# EAGLE schematic word_clock (EAGLE 7.2.0)
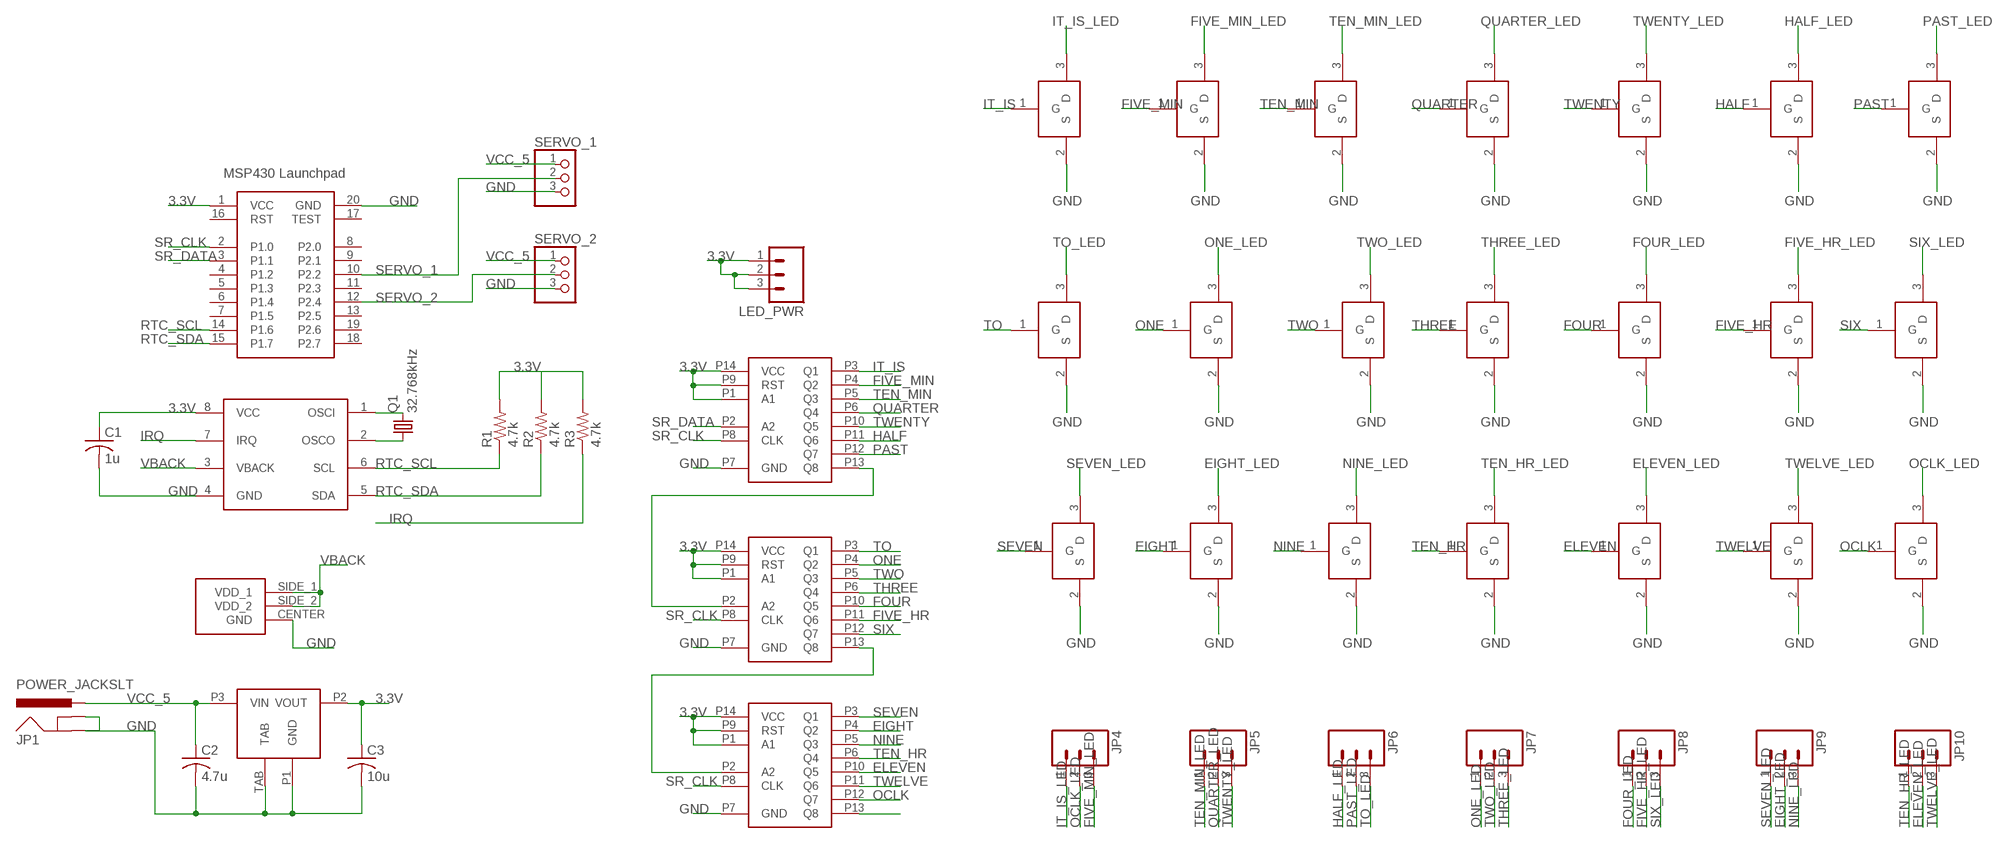
[diagram p0: schematic, sheet 1]

## Parts
1H  FET  [SOT23]
2H  FET  [SOT23]
3H  FET  [SOT23]
4H  FET  [SOT23]
5H  FET  [SOT23]
5M  FET  [SOT23]
6H  FET  [SOT23]
7H  FET  [SOT23]
8H  FET  [SOT23]
9H  FET  [SOT23]
10H  FET  [SOT23]
10M  FET  [SOT23]
11H  FET  [SOT23]
12H  FET  [SOT23]
15M  FET  [SOT23]
20M  FET  [SOT23]
30M  FET  [SOT23]
C1  1u  C-US050-025X075  [C050-025X075]
C2  4.7u  C-US050-025X075  [C050-025X075]
C3  10u  C-US050-025X075  [C050-025X075]
ITIS  FET  [SOT23]
JP1  POWER_JACKSLT  [POWER_JACK_SLOT]
JP4  M03-SCREW-5MM  [SCREWTERMINAL-5MM-3]
JP5  M03-SCREW-5MM  [SCREWTERMINAL-5MM-3]
JP6  M03-SCREW-5MM  [SCREWTERMINAL-5MM-3]
JP7  M03-SCREW-5MM  [SCREWTERMINAL-5MM-3]
JP8  M03-SCREW-5MM  [SCREWTERMINAL-5MM-3]
JP9  M03-SCREW-5MM  [SCREWTERMINAL-5MM-3]
JP10  M03-SCREW-5MM  [SCREWTERMINAL-5MM-3]
LED_PWR  M03-SCREW-5MM  [SCREWTERMINAL-5MM-3]
OCLK  FET  [SOT23]
PAST  FET  [SOT23]
Q1  32.768kHz  CRYSTALTC26V  [TC26V]
R1  4.7k  R-US_0207/10  [0207/10]
R2  4.7k  R-US_0207/10  [0207/10]
R3  4.7k  R-US_0207/10  [0207/10]
RTC  RTC  [SOIC8]
SERVO_1  PINHD-1X3  [1X03]
SERVO_2  PINHD-1X3  [1X03]
SR_1  SHIFT_REGISTER  [SHIFT_REGISTER]
SR_2  SHIFT_REGISTER  [SHIFT_REGISTER]
TO  FET  [SOT23]
U$1  SHIFT_REGISTER  [SHIFT_REGISTER]
U$4  LDO  [LDO]
U$25  MSP430  [MSP430]
U$28  COIN_CELL_SPARKFUN  [COIN_CELL_SPARKFUN]

## Nets
3.3V: C1.1 C3.1 LED_PWR.1 LED_PWR.2 LED_PWR.3 R1.2 R2.2 R3.2 RTC.8(VCC) SR_1.P1(A1) SR_1.P9(RST) SR_1.P14(VCC) SR_2.P1(A1) SR_2.P9(RST) SR_2.P14(VCC) U$1.P1(A1) U$1.P9(RST) U$1.P14(VCC) U$4.P2(VOUT) U$25.1(VCC)
EIGHT: 8H.1(G) U$1.P4(Q2)
EIGHT_LED: 8H.3(D) JP9.2
ELEVEN: 11H.1(G) U$1.P10(Q5)
ELEVEN_LED: 11H.3(D) JP10.2
FIVE_HR: 5H.1(G) SR_2.P11(Q6)
FIVE_HR_LED: 5H.3(D) JP8.2
FIVE_MIN: 5M.1(G) SR_1.P4(Q2)
FIVE_MIN_LED: 5M.3(D) JP4.3
FOUR: 4H.1(G) SR_2.P10(Q5)
FOUR_LED: 4H.3(D) JP8.1
GND: 1H.2(S) 2H.2(S) 3H.2(S) 4H.2(S) 5H.2(S) 5M.2(S) 6H.2(S) 7H.2(S) 8H.2(S) 9H.2(S) 10H.2(S) 10M.2(S) 11H.2(S) 12H.2(S) 15M.2(S) 20M.2(S) 30M.2(S) C1.2 C2.2 C3.2 ITIS.2(S) JP1.GND@1(GNDBREAK) JP1.GND@2(GND) OCLK.2(S) PAST.2(S) RTC.4(GND) SERVO_1.3 SERVO_2.3 SR_1.P7(GND) SR_2.P7(GND) TO.2(S) U$1.P7(GND) U$4.P1(GND) U$4.TAB U$25.20(GND) U$28.CENTER(GND)
HALF: 30M.1(G) SR_1.P11(Q6)
HALF_LED: 30M.3(D) JP6.1
IRQ: R3.1 RTC.7(IRQ)
IT_IS: ITIS.1(G) SR_1.P3(Q1)
IT_IS_LED: ITIS.3(D) JP4.1
N$1: Q1.1 RTC.2(OSCO)
N$2: Q1.2 RTC.1(OSCI)
N$4: SR_1.P13(Q8) SR_2.P2(A2)
N$5: SR_2.P13(Q8) U$1.P2(A2)
N$7: U$1.P13(Q8)
NINE: 9H.1(G) U$1.P5(Q3)
NINE_LED: 9H.3(D) JP9.3
OCLK: OCLK.1(G) U$1.P12(Q7)
OCLK_LED: JP4.2 OCLK.3(D)
ONE: 1H.1(G) SR_2.P4(Q2)
ONE_LED: 1H.3(D) JP7.1
PAST: PAST.1(G) SR_1.P12(Q7)
PAST_LED: JP6.2 PAST.3(D)
QUARTER: 15M.1(G) SR_1.P6(Q4)
QUARTER_LED: 15M.3(D) JP5.2
RTC_SCL: R1.1 RTC.6(SCL) U$25.14(P1.6)
RTC_SDA: R2.1 RTC.5(SDA) U$25.15(P1.7)
SERVO_1: SERVO_1.2 U$25.10(P2.2)
SERVO_2: SERVO_2.2 U$25.12(P2.4)
SEVEN: 7H.1(G) U$1.P3(Q1)
SEVEN_LED: 7H.3(D) JP9.1
SIX: 6H.1(G) SR_2.P12(Q7)
SIX_LED: 6H.3(D) JP8.3
SR_CLK: SR_1.P8(CLK) SR_2.P8(CLK) U$1.P8(CLK) U$25.2(P1.0)
SR_DATA: SR_1.P2(A2) U$25.3(P1.1)
TEN_HR: 10H.1(G) U$1.P6(Q4)
TEN_HR_LED: 10H.3(D) JP10.1
TEN_MIN: 10M.1(G) SR_1.P5(Q3)
TEN_MIN_LED: 10M.3(D) JP5.1
THREE: 3H.1(G) SR_2.P6(Q4)
THREE_LED: 3H.3(D) JP7.3
TO: SR_2.P3(Q1) TO.1(G)
TO_LED: JP6.3 TO.3(D)
TWELVE: 12H.1(G) U$1.P11(Q6)
TWELVE_LED: 12H.3(D) JP10.3
TWENTY: 20M.1(G) SR_1.P10(Q5)
TWENTY_LED: 20M.3(D) JP5.3
TWO: 2H.1(G) SR_2.P5(Q3)
TWO_LED: 2H.3(D) JP7.2
VBACK: RTC.3(VBACK) U$28.SIDE_1(VDD_1) U$28.SIDE_2(VDD_2)
VCC_5: C2.1 JP1.PWR SERVO_1.1 SERVO_2.1 U$4.P3(VIN)
Unconnected: U$25.4(P1.2) U$25.5(P1.3) U$25.6(P1.4) U$25.7(P1.5) U$25.8(P2.0) U$25.9(P2.1) U$25.11(P2.3) U$25.13(P2.5) U$25.16(RST) U$25.17(TEST) U$25.18(P2.7) U$25.19(P2.6)

## Library data of the parts
1H 2H 3H 4H 5H 5M 6H 7H 8H 9H 10H 10M 11H 12H 15M 20M 30M ITIS OCLK PAST TO = word_clock:FET: nFET 2N7002P NXP Semiconductor
C1-C3 = rcl:C-US: CAPACITOR, American symbol
JP1 = SparkFun-Connectors:POWER_JACK: Power Jack This is the standard 5.5mm barrel jack for power. The PTH is the most common, proven, reliable, footprint. The Slot footprint only works if the mill layer is transmitted to the PCB fab house so be warned. Mating wall wart : TOL-00298 (and others); PROD_ID: PRT-00119
JP4-JP10 LED_PWR = SparkFun-Connectors:M03: Header 3 Standard 3-pin 0.1" header. Use with straight break away headers (SKU : PRT-00116), right angle break away headers (PRT-00553), swiss pins (PRT-00743), machine pins (PRT-00117), and female headers (PRT-00115). Molex polarized connector foot print use with SKU : PRT-08232 with associated crimp pins and housings.; STOREFRONT_ID: PRT-08433
Q1 = crystal:CRYSTAL: CRYSTAL; OC_FARNELL: unknown; OC_NEWARK: unknown
R1-R3 = rcl:R-US_: RESISTOR, American symbol
RTC = word_clock:RTC
SERVO_1 SERVO_2 = pinhead:PINHD-1X3: PIN HEADER
SR_1 SR_2 U$1 = word_clock:SHIFT_REGISTER: 8 bit serial to parallel shift register pull reset low, holds output low next bit is (A1 AND A2) - should pull one high to be safe, toggle the other
U$4 = word_clock:LDO: 3.3V LDO Regulator SPX1587 TO-263 Package
U$25 = word_clock:MSP430
U$28 = eoh:COIN_CELL_SPARKFUN